# Altium project pcb_thermoklok.PrjPcb
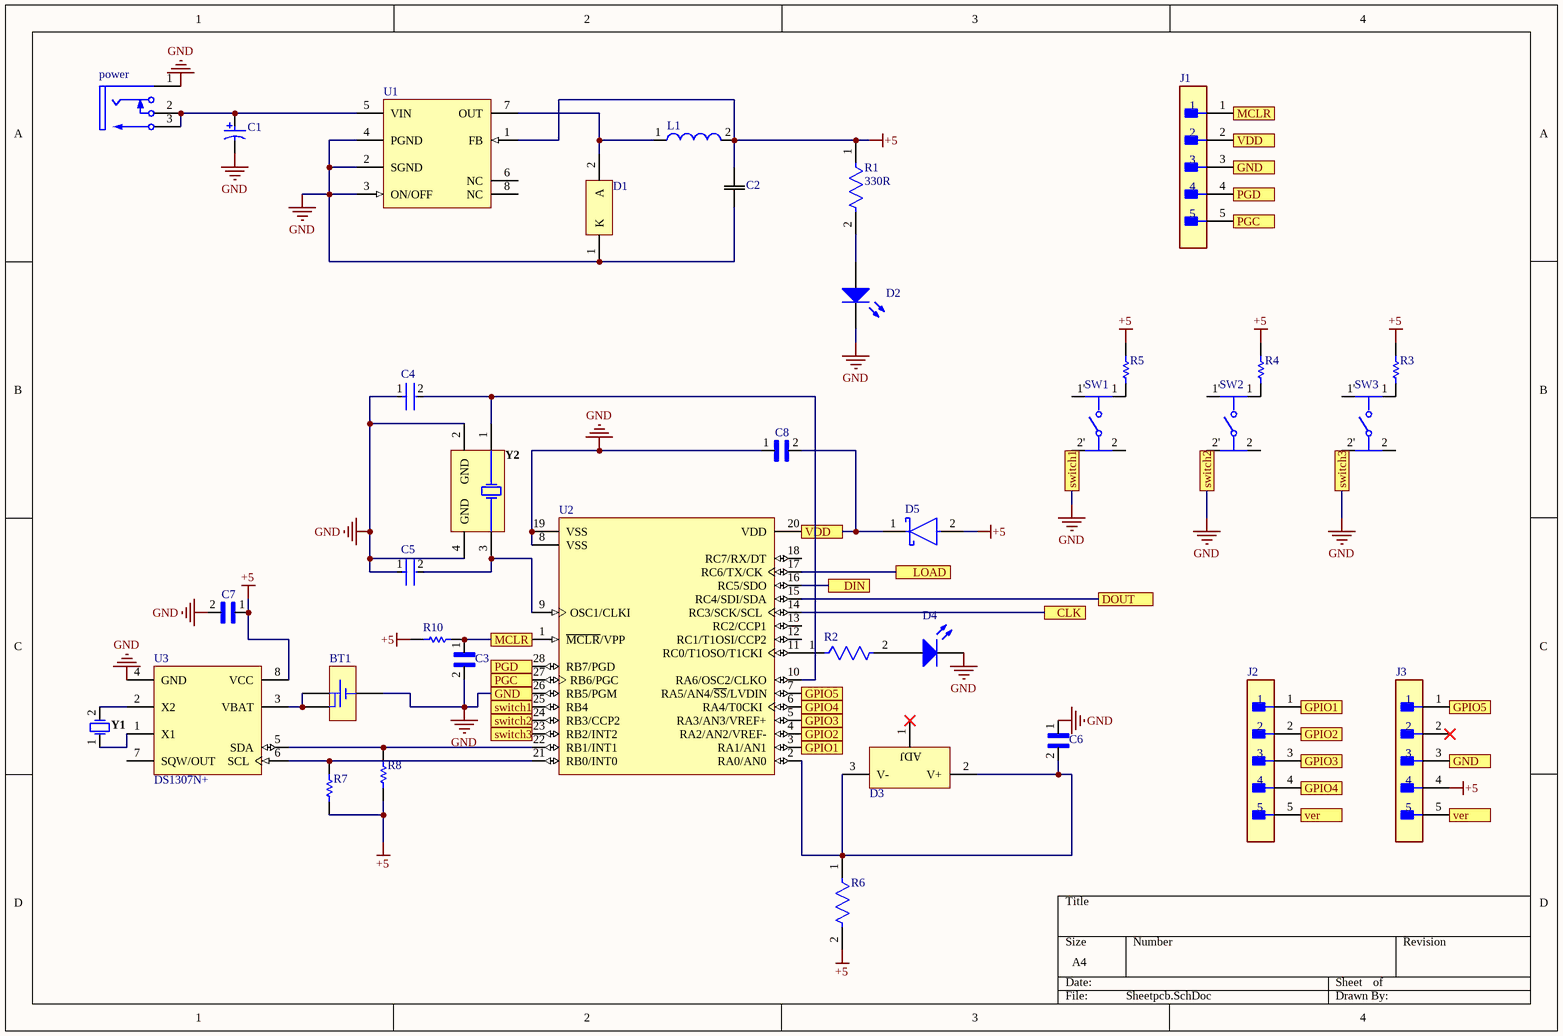
[diagram p0: Sheetpcb.SchDoc]
1 sheet, 36 parts. Net scope: flat (ports and power ports of the same name join across sheets).
Board file: PCB1.PcbDoc

## Sheet Sheetpcb.SchDoc
size A4; SheetNumber: 1; SheetTotal: 2

### Parts
BT1  BAT-HLD-001  [BAT-2]  (value not drawn)
C1  TAJB226K016RNJ  [TO-226-AA]  (value not drawn)
C2  UUD1C221MCL1GS  [NIC-CAPA2-6.3X7.7_V]  (value not drawn)
C3  1206J0630104MXT  [C1206]  (value not drawn)
C4  C0805C220J5GACTU  [6-0805_M]  (value not drawn)
C5  C0805C220J5GACTU  [6-0805_M]  (value not drawn)
C6  1206J0630104MXT  [C1206]  (value not drawn)
C7  1206J0630104MXT  [C1206]  (value not drawn)
C8  1206J0630104MXT  [C1206]  (value not drawn)
D1  MBR150  [ONSC-AXIAL_LEAD-2-59-10_P]  (value not drawn)
D2  151051RS11000  [Type 5mm]  (value not drawn)
D3  LM335AZ/NOPB  [LP0003A]  (value not drawn)
D4  151033GS03000  [3.2X1.6X1.1]  (value not drawn)
D5  BAT42WS-7-F  [FP-SOD323-MFG]  (value not drawn)
J1  IPL1-105-02-L-S-K  [FP-IPL1-105-02-L-S-K-0]  (value not drawn)
J2  IPL1-105-02-L-S-K  [FP-IPL1-105-02-L-S-K-0]  (value not drawn)
J3  IPL1-105-02-L-S-K  [FP-IPL1-105-02-L-S-K-0]  (value not drawn)
L1  744775215  [0402-A]  (value not drawn)
power  RAPC712X  [SWITCH-RAPC712X-3_V]  (value not drawn)
R1  330R  [J1-0603]
R2  CRCW1206330RFKEA  [J1-0603]  (value not drawn)
R3  CRCW120610K0JNEA  [J1-0603]  (value not drawn)
R4  CRCW120610K0JNEA  [J1-0603]  (value not drawn)
R5  CRCW120610K0JNEA  [J1-0603]  (value not drawn)
R6  CRCW12062K00FKEA  [J1-0603]  (value not drawn)
R7  CRCW120610K0JNEA  [J1-0603]  (value not drawn)
R8  CRCW120610K0JNEA  [J1-0603]  (value not drawn)
R10  CRCW120610K0JNEA  [J1-0603]  (value not drawn)
SW1  EVQ-P7A01P  [FP-EVQ-P7A01P-MFG]  (value not drawn)
SW2  EVQ-P7A01P  [FP-EVQ-P7A01P-MFG]  (value not drawn)
SW3  EVQ-P7A01P  [FP-EVQ-P7A01P-MFG]  (value not drawn)
U1  LM2574N-5.0/NOPB  [P0008A]  (value not drawn)
U2  PIC18F252-I/SP  [MCHP-SPDIP-SP28]  (value not drawn)
U3  DS1307N+  [P8+2]
Y1  AB26T-32.768KHZ  [ABRA-AB26T]  (value not drawn)
Y2  7M-27.120MEEQ-T  [R38]  (value not drawn)

### Ports
CLK, DIN, DOUT, GND, GPIO1, GPIO2, GPIO3, GPIO4, GPIO5, LOAD, MCLR, PGC, PGD, switch1, switch2, switch3, VDD, ver

### Nets
+5: C2.2 C7.1 D5.2(A) J3.4 L1.2 R1.1 R3.2 R4.2 R5.2 R6.2 R7.2 R8.1 R10.1 U1.1(FB) U3.8(VCC)
GND: BT1.1(-) C1.2 C2.1 C3.2 C4.1 C5.1 C6.1 C7.2 C8.1 D1.1(K) D2.1(K) D4.1(K) J1.3 J3.3 power.1 SW1.2' SW2.2' SW3.2' U1.2(SGND) U1.3(ON/OFF) U1.4(PGND) U2.8(VSS) U2.19(VSS) U2.23(RB2/INT2) U2.24(RB3/CCP2) U2.25(RB4) U2.26(RB5/PGM) U3.4(GND) Y2.2(GND) Y2.4(GND) ; port GND, port switch1, port switch2, port switch3
NetBT1_2: BT1.2(+) BT1.3(+) U3.3(VBAT)
NetC1_1: C1.1 power.2 power.3 U1.5(VIN)
NetC3_1: C3.1 J1.1 R10.2 U2.1(~{MCLR}/VPP) ; port MCLR
NetC4_2: C4.2 U2.10(RA6/OSC2/CLKO) Y2.1(X1)
NetC5_2: C5.2 U2.9(OSC1/CLKI) Y2.3(X2)
NetC6_2: C6.2 D3.2(V+) D3.3(V-) R6.1 U2.2(RA0/AN0)
NetC8_2: C8.2 D5.1(C) J1.2 U2.20(VDD) ; port VDD
NetD1_2: D1.2(A) L1.1 U1.7(OUT)
NetD2_2: D2.2(A) R1.2
NetD4_2: D4.2(A) R2.2
NetJ1_4: J1.4 U2.28(RB7/PGD) ; port PGD
NetJ1_5: J1.5 U2.27(RB6/PGC) ; port PGC
NetJ2_1: J2.1 U2.3(RA1/AN1) ; port GPIO1
NetJ2_2: J2.2 U2.4(RA2/AN2/VREF-) ; port GPIO2
NetJ2_3: J2.3 U2.5(RA3/AN3/VREF+) ; port GPIO3
NetJ2_4: J2.4 U2.6(RA4/T0CKI) ; port GPIO4
NetJ2_5: J2.5 J3.5 ; port ver
NetJ3_1: J3.1 U2.7(RA5/AN4/~{SS}/LVDIN) ; port GPIO5
NetR2_1: R2.1 U2.11(RC0/T1OSO/T1CKI)
NetR3_1: R3.1 SW3.1
NetR4_1: R4.1 SW2.1
NetR5_1: R5.1 SW1.1
NetR7_1: R7.1 U2.21(RB0/INT0) U3.6(SCL)
NetR8_2: R8.2 U2.22(RB1/INT1) U3.5(SDA)
NetU2_14: U2.14(RC3/SCK/SCL) ; port CLK
NetU2_15: U2.15(RC4/SDI/SDA) ; port DOUT
NetU2_16: U2.16(RC5/SDO) ; port DIN
NetU2_17: U2.17(RC6/TX/CK) ; port LOAD
NetU3_1: U3.1(X1) Y1.1
NetU3_2: U3.2(X2) Y1.2

Not connected (* = marked no-connect by the designer): D3 1(ADJ)*; J3 2*; SW1 1' 2; SW2 1' 2; SW3 1' 2; U1 6(NC) 8(NC); U2 12(RC1/T1OSI/CCP2) 13(RC2/CCP1) 18(RC7/RX/DT); U3 7(SQW/OUT)

### Library data of the parts
BT1 = battery holder: 20mm Coin Cell Battery Holder; Manufacturer: Linx; PCB_Layout: Complies with manufacturer's recommendation.; DatasheetVersion: rev1.0, Dec-2007; PackageVersion: rev1.0, Dec-2007; PackageReference: BATHLD-001; PackageDescription: Low Profile SM Battery Holder, 20mm Lithium Cell, 21.1 x 15.3 x 4.2 mm Body; Manufacturer Part Number: BAT-HLD-001
C1 = 22uf 16 v tantalum capicitor: Standard Tantalum, 22 uF, +/- 10%, 16 V, -55 to 125 degC, 2-Pin SMD (1210), RoHS, Tape and Reel; Manufacturer: AVX; Manufacturer: Kyocera AVX; Leakage Current: 3.5uA; Dissipation Factor: 6%; Voltage Rating (DC): 16V; Capacitance: 22uF; ESR (Equivalent Series Resistance): 2.3Ohm; Polarity: Polar; Package Quantity: 1; Tolerance: 10%; Number of Pins: 2; Manufacturer URL: http://www.avx.com/; Height - Seated (Max): 0.083inch; Case Code (Imperial): 1210; Package Reference: TAJ-B-2; Height: 1.9mm; Depth: 2.8mm; Packaging: TapeandReel; Termination: SMD/SMT; Case/Package: 1210; Lead Free: LeadFree; Min Operating Temperature: -55degC; RoHSCompliant: True; Dielectric Material: Tantalum; Case Code (Metric): 3528; Width: 2.8mm; Datasheet URL: http://datasheets.avx.com/TAJ.pdf; Radiation Hardening: No; Package Description: 2-Pin Surface Mount Device, Body 3.5 x 2.85 mm; Length: 3.5mm; Voltage Rating: 16V; Datasheet Version: 42401.0; Max Operating Temperature: 125degC; REACH SVHC: NoSVHC; Voltage: 16V; Manufacturer Part Number: TAJB226K016RNJ
C2 = UUD1C221MCL1GS: No Description Available; Vendor: Nichicon; Built_By: EMA_UL_Team; SourceLibrary: Nichicon_2014-12-31; Type: DEV; Manufacturer_Part_Number: UUD1C221MCL1GS; Copyright: Copyright (C) 2018 Accelerated Designs. All rights reserved; RefDes: RefDes
C3 C6-C8 = 100nf 63v ceramic capacitor: 63V Ceramic Capacitor; MF: Knowles Syfer; MP: 1206J0630104MXT; SnapEDA_Link: https://www.snapeda.com/parts/1206J0630104MXT/Knowles%20Syfer/view-part/4314687/?ref=snap; DigiKey-Purchase-URL: https://snapeda.com/shop?store=DigiKey&id=4314687; Mouser-Purchase-URL: https://snapeda.com/shop?store=Mouser&id=4314687; Value: *; Digi-Key_Part_Number: 1608-1392-1-ND; Package: 3216 Knowles Syfer
C4 C5 = 22pf 50v ceramic capacitor: Capacitor; Ceramic; Cap; 22.0pF; Tol 5%; SMT; Vol-Rtg 50V; C0G; Tape and Reel; Manufacturer: KEMET; Temperature Coefficient: 30ppm/°C; Capacitance: 22 pF; Value: 22 pF; Tolerance: 0.05; Device Class L1: Passive Components; Mouser Description: Multilayer Ceramic Capacitors MLCC - SMD/SMT 50volts 22pF C0G 5%; Temperature Range Low: -55°C; Automotive: No; Voltage Rating: 50 V; Material: Ceramic; Category: Cap; Height: 0.88mm; Temperature Range High: +125°C; Digikey Description: Capacitor; Ceramic; Cap; 22.0pF; Tol 5%; SMT; Vol-Rtg 50V; C0G; Tape and Reel; Octopart: https://octopart.com/c0805c220j5gactu-kemet-145470; ComponentLink2Description: Datasheet; Device Class L2: Capacitors; Ipc Land Pattern Name: CAPC200125X78; RoHS: TRUE; ComponentLink2URL: https://content.kemet.com/datasheets/KEM_C1003_C0G_SMD.pdf; Temperature: -55°C to +125°C; Device Class L3: Ceramic Capacitors; Lead Free: Yes; Manufacturer Part Number: C0805C220J5GACTU; Temperature Characteristic: C0G; Package: C0805C-DN
D1 = CMP-1055-00047-1: Rectifier, 2-Pin Axial_Lead, Pb-Free, Bulk Bag; Manufacturer: On Semiconductor; IFSM Max (A): 25; Configuration: Single; DatasheetVersion: Rev. 8; ComponentLink1URL: http://www.onsemi.com/; PartNumber: MBR150; ComponentLink2Description: Datasheet; Mounting Technology: Through Hole; RoHS: TRUE; ComponentLink1Description: Manufacturer URL; ComponentLink2URL: http://www.onsemi.cn/pub_link/Collateral/MBR150-D.PDF; Packing: Bulk Bag; PackageVersion: Rev. U, 02/2005; ComponentLink3Description: Package Specification; PackageDescription: 2-Pin, Axial Lead, Diameter 2.35 mm; PackageReference: AXIAL_LEAD-2-59-10; ComponentLink3URL: http://www.onsemi.cn/pub_link/Collateral/59-10.PDF
D2 = CMP-1488-00008-1: THT LED round mono-color color lens, WL-TMRW, Red; Manufacturer: Wuerth Elektronik; PackageReference: Type 5mm; PartNumber: 151051RS11000; ComponentLink2URL: http://katalog.we-online.de/pbs/datasheet/7448042001.pdfhttp://katalog.we-online.de/pbs/datasheet/7448042001.pdfhttp://katalog.we-online.de/pbs/datasheet/7448042001.pdfhttp://katalog.we-online.de/pbs/datasheet/151051RS11000.pdf; ComponentLink1URL: http://www.we-online.com; ComponentLink1Description: Manufacturer URL; ComponentLink2Description: Datasheet; Emitting color: Red
D3 = temperature sensor: Precision Temperature Sensor, 3-pin TO-92, Pb-Free; Manufacturer: Texas Instruments; Manufacturer: TI National Semiconductor; PowerWise: N; CompType: Temp Sensor IC; PackageTopMarking: NSXYTT*LM335*AZ; PinCount: 3; ComponentLink1URL: http://www.ti.com/general/docs/lit/getliterature.tsp?genericPartNumber=LM335&fileType=pdf; Code_JEDEC: TO-226-AA; RoHS: Y; ComponentLink1Description: Datasheet URL; PackageReference: LP0003A; PackageDescription: TO-92, Molded, 3 Lead; Manufacturer Part Number: LM335AZ/NOPB
D4 = green led: THT LED round mono-color waterclear, THT WL-TMRW ,Green; Manufacturer: Wuerth Elektronik; Manufacturer: Wurth Electronics; ComponentLink2URL: http://katalog.we-online.de/pbs/datasheet/7448042001.pdfhttp://katalog.we-online.de/pbs/datasheet/7448042001.pdfhttp://katalog.we-online.de/pbs/datasheet/7448042001.pdfhttp://katalog.we-online.de/pbs/datasheet/151033GS03000.pdf; ComponentLink2Description: Datasheet; Emitting color: Green; ComponentLink1Description: Manufacturer URL; PackageReference: Type 3mm; PartNumber: 151033GS03000; ComponentLink1URL: http://www.we-online.com; Manufacturer Part Number: 151033GS03000
D5 = 30v schottky diode 200mA: DIODE SCHOTTKY 30V 200MA SOD323; Manufacturer: Diodes Inc.; Manufacturer: Diodes; Max Junction Temp: +125°C; Peak Reverse Current: 0.5uA; Max Surge Forward Current: 4A; Standoff Height: 0.05mm; Capacitance: 10pF; Value: 10pF; Package: SOD323; Max Repetitive Reverse Voltage: 30V; Digikey Description: DIODE SCHOTTKY 30V 200MA SOD323; Forward Current: 200mA; Lead Free: Yes; Device Class L1: Discrete Semiconductors; Height: 1.2mm; Mouser Description: Schottky Diodes & Rectifiers 30V 200mW; Footprint Url: https://www.diodes.com/assets/Package-Files/SOD323.pdf; Automotive: No; Device Class L3: Schottky Diodes; Temperature: -55°C to +125°C; ComponentLink2Description: Datasheet; Temperature Range High: +125°C; Manufacturer Part Number: BAT42WS-7-F; ComponentLink2URL: https://www.diodes.com/assets/Datasheets/ds30100.pdf; Reverse Voltage: 30V; Octopart: https://octopart.com/bat42ws-7-f-diodes+inc.-326107; Temperature Range Low: -55°C; Category: Diode; RoHS: TRUE; Device Class L2: Diodes
J1-J3 = 5 header: 5 Position 1 Row .100" (2.54 mm) pitch connector; Manufacturer: Samtec; Number of Positions: 5; Max Current Rating: 7.4A; Pitch: 2.54mm; Connector Type: Male Pin; Max Voltage Rating (AC): 675V; Number of Ports: 1; Gender: Male; Termination: Solder; Min Operating Temperature: -55°C; Max Operating Temperature: 125°C; Mount: Surface Mount; Contact Material: Bronze; Housing Material: Polymer; Depth: 7.04mm; Color: Natural; REACH SVHC: No SVHC; Radiation Hardening: No; Orientation: Straight; Fastening Type: Ramp; Contact Mating Length: 0.215inch; Number of Terminals/Pins: 5; Number of Rows: 1; Packaging: Rail/Tube; Contact Plating: Gold; Length: 14.22mm; Number of Contacts: 5; Lead Free: Lead Free; Manufacturer Part Number: IPL1-105-02-L-S-K
L1 = 150 uh inductor: SMD Power Inductor WE-PD2, L = 150 µH; Manufacturer: Wurth Electronics; Inductance: 150 ÂµH; ComponentLink1Description: Manufacturer Link; ComponentLink2Description: Datasheet; DatasheetVersion: ver 1, Oct-2004; ComponentLink1URL: http://www.we-online.com; PackageDescription: SMD Inductor, 2-Leads, Body 7.8 x 7.0 mm; PackageVersion: 2004; PackageReference: WE-PD2-L; ComponentLink2URL: http://www.we-online.de/katalog/media/pdf/744775215.pdf; Manufacturer Part Number: 744775215
power = CMP-2000-05383-1: Conn Powerjack Mini R/A PCMT, 5 A, 3-Pin THD, RoHS; Manufacturer: Switchcraft; Gender: Male; Current Rating: 5A; Connector Type: Jack; Dynamic Catalog: SwitchcraftInc; Other Names: Q2387461 / Q2526383 / RAPC712X-ND / SC237; Internal Switch(s): SingleSwitch,NormallyClosed; Catalog Drawings: RAPC7(1,2)2XSide / RAPC7(1,2)2XTop; Plug/Mating Plug Diameter: 2.5mmID,5.5mmOD; Number of Positions/Contacts: 2Conductors,2Contacts; Shielding: Unshielded; Mating Products: SC1539-ND / -CONNPLUGMINIPWR2CONDBLK/RED / SC1051-ND / -CONNPLUGMINIPOWER2CONDBLACK; Mounting Type: ThroughHole,RightAngle; Manufacturer URL: http://www.switchcraft.com/; Contact Material: Brass; Standard Package: 2,500; RoHS Information: SwitchcraftRoHSInfo; Termination: SolderEyelet(s); Housing Color: Black; Datasheet Version: Rev. A, 08/2005; Family: Barrel-PowerConnectors; Housing Material: Thermoplastic; Color: Black; Datasheet URL: https://datasheet.ciiva.com/391/rapc712x-cd-391666.pdf; Category: Connectors,Interconnects; Contact Material - Plating: Nickel
R1 = 330 ohm resistor: RES Thick Film, 330Ω, 1%, 0.25W, 100ppm/°C, 1206; Manufacturer: Vishay; Manufacturer Part Number: CRCW1206330RFKEA; Voltage Rating: 200V; Max Power Dissipation: 250mW; Height: 0.55mm; Mount: Surface Mount; Min Operating Temperature: -55°C; Depth: 1.6mm; Features: Automotive AEC-Q200; Voltage Rating (DC): 200V; Military Standard: Not; Packaging: Tape and Reel; Composition: Thick Film; Contact Plating: Tin; Case Code (Imperial): 1206; Case/Package: 1206; Number of Terminations: 2; Length: 3.2mm; Lead Free: Lead Free; Tolerance: 1%; Resistance: 330R; Temperature Coefficient: 100ppm/°C; Case Code (Metric): 3216; Width: 1.6mm; Weight: 0.000353oz; Termination: SMD/SMT; Radiation Hardening: No; Package Quantity: 10; Power Rating: 250mW; Max Operating Temperature: 155°C
R2 = 330 ohm resistor: RES Thick Film, 330Ω, 1%, 0.25W, 100ppm/°C, 1206; Manufacturer: Vishay; Voltage Rating: 200V; Resistance: 330R; Max Power Dissipation: 250mW; Height: 0.55mm; Mount: Surface Mount; Min Operating Temperature: -55°C; Depth: 1.6mm; Features: Automotive AEC-Q200; Voltage Rating (DC): 200V; Military Standard: Not; Packaging: Tape and Reel; Composition: Thick Film; Contact Plating: Tin; Case Code (Imperial): 1206; Case/Package: 1206; Number of Terminations: 2; Length: 3.2mm; Lead Free: Lead Free; Tolerance: 1%; Temperature Coefficient: 100ppm/°C; Case Code (Metric): 3216; Width: 1.6mm; Weight: 0.000353oz; Termination: SMD/SMT; Radiation Hardening: No; Package Quantity: 10; Power Rating: 250mW; Max Operating Temperature: 155°C; Manufacturer Part Number: CRCW1206330RFKEA
R3-R5 R7 R8 R10 = 10K ohm resistor: Manufacturer: Vishay Dale; Part Number: CRCW120610K0JNEA; Manufacturer Part Number: CRCW120610K0JNEA
R6 = 2Kohm resistor: RES Thick Film, 2kΩ, 1%, 0.25W, 100ppm/°C, 1206; Manufacturer: Vishay; Manufacturer: Vishay Dale; Manufacturer Part Number: CRCW12062K00FKTC; Manufacturer: Yageo; Manufacturer Part Number: RC1206FR-072KL; Manufacturer: Panasonic; Manufacturer Part Number: ERJ-8ENF2001V; Manufacturer Part Number: CRCW12062K00FKTA; Manufacturer Part Number: CRCW12062K00FKTB; Manufacturer: Bourns; Manufacturer Part Number: CR1206-FX-2001ELF; Manufacturer: Rohm; Manufacturer Part Number: MCR18EZPF2001; Manufacturer Part Number: CRCW12062K00FKEB; Max Power Dissipation: 250mW; Voltage Rating: 200V; Resistance: 2kR; Package Quantity: 10; Height: 0.55mm; Tolerance: 1%; Number of Terminations: 2; Mount: Surface Mount; Width: 1.6mm; Length: 3.2mm; Features: Automotive AEC-Q200; Contact Plating: Tin; Number of Pins: 2; Weight: 0.000353oz; Max Operating Temperature: 155°C; Min Operating Temperature: -55°C; Termination: SMD/SMT; Temperature Coefficient: 100ppm/°C; Case Code (Imperial): 1206; Depth: 1.6mm; Military Standard: Not; Case Code (Metric): 3216; Composition: Thick Film; Power Rating: 250mW; Case/Package: 1206; Radiation Hardening: No; Packaging: Tape and Reel; Manufacturer Part Number: CRCW12062K00FKEA
SW1-SW3 = switch: SWITCH TACTILE SPST-NO 0.05A 12V; Manufacturer: Panasonic; Operating Force: 2.2N; Contact Resistance: 500mΩ; Contact Current Rating: 50mA; Electromechanical Life: 100000Cycles; Device Class L2: Switches; Lead Free: Yes; Mount: Surface Mount; Digikey Description: SWITCH TACTILE SPST-NO 0.05A 12V; Temperature Range High: +70°C; Device Class L3: Tactile Switches; Package: EVQ-P7A01P; Voltage Rating Dc: 12V; Octopart: https://octopart.com/evq-p7a01p-panasonic-29917075; ComponentLink2URL: https://industrial.panasonic.com/cdbs/www-data/pdf/ATK0000/ATK0000C378.pdf; Automotive: No; Device Class L1: Electromechanical; Mouser Description: SWITCH TACTILE SPST-NO 0.05A 12V; Temperature: -20°C to +70°C; Manufacturer Part Number: EVQ-P7A01P; ComponentLink2Description: Datasheet; RoHS: TRUE; Category: Switch; Temperature Range Low: -20°C; Throw Configuration: SPST-NO; Height: 1.55mm
U1 = 0.5A stepdown conveter: SIMPLE SWITCHER® 0.5A Step-Down Voltage Regulator, 8-pin MDIP, Pb-Free; Manufacturer: Texas Instruments; Manufacturer: TI National Semiconductor; PowerWise: N; PackageTopMarking: NSUZXYTTE#*LM2574N*-5.0 P+; PinCount: 8; ComponentLink1URL: http://www.ti.com/general/docs/lit/getliterature.tsp?genericPartNumber=LM2574&fileType=pdf; CompType: Switcher; Code_JEDEC: MS-001-BA; ComponentLink1Description: Datasheet URL; RoHS: Y; PackageDescription: MDIP, .365 x .250 x .130in, 8 Lead, .100in Pitch; PackageReference: P0008A; Manufacturer Part Number: LM2574N-5.0/NOPB
U2 = microcontroller: High Performance, Enhanced Flash Microcontroller with 10-Bit A/D, 40 MHz, 23 I/O, -40 to 85 degC, 28-pin SPDIP (SP28), Tube; Manufacturer: Microchip; # of A/D Channels: 5; Program Memory KBytes: 32; Operation Voltage Range: 4.2V - 5.5V; Program Memory KWords: 16; RAM: 1536; Timers: 1 - 8-bit, 3 - 16-bit; EEPROM Data Memory (bytes): 256; Max. CPU Speed MHz: 40; I/O Pins: 23; Digital Communication: 0 -UART, 1 -A/E/USART, 0 -SPI, 0 -I2C, 1 -MSSP(SPI/I2C); ComponentLink3URL: Product URL:http://www.microchip.com/datasheet/PIC18F252; PackageReference: SPDIP-SP28; RoHS: TRUE; ComponentLink1URL: http://ww1.microchip.com/downloads/en/DeviceDoc/39564c.pdf; PackageDescription: 28-Lead Plastic Dual In-Line, 34.86 x 6.79 mm Body, 2.54 mm Pitch; PartNumber: PIC18F252-I/SP; ComponentLink1Description: Datasheet; Memory Type: Flash; Packing: TUBE; ComponentLink2URL: http://www.microchip.com/stellent/groups/techpub_sg/documents/packagingspec/en012702.pdf; DatasheetVersion: Rev. C; ComponentLink2Description: Package Specification; ComponentLink3Description: URL Link1; Mounting Technology: Through Hole; PackageVersion: C04-070B, 12/2012; Manufacturer Part Number: PIC18F252-I/SP
U3 = clock: 64 x 8, Serial, I2C Real-Time Clock, 5.0V, 8-Pin PDIP, -40 to 85 degC, Pb-Free; Manufacturer: Maxim; ComponentLink1Description: Manufacturer URL; ComponentLink2Description: Datasheet; DatasheetVersion: 10-Feb-2008; PackageDescription: 8-Pin Plastic Dual-In-Line, Narrow (0.3in), Pitch 2.54 mm, PDIP(N), Pb-Free; ComponentLink3URL: http://pdfserv.maxim-ic.com/package_dwgs/21-0043.PDF; PackageReference: P8+2; PackageVersion: revE, 2011; ComponentLink3Description: Package Specification; Code_JEDEC: MS-001-AB; ComponentLink1URL: http://www.maxim-ic.com; ComponentLink2URL: http://datasheets.maxim-ic.com/en/ds/DS1307.pdf; Manufacturer Part Number: DS1307N+
Y1 = 32.768 Khz crystal: Crystal, 12.5 pF, 32.768 KHz, -10 to 60 degC, 2-Pin THD, RoHS, Bulk; Manufacturer: ABRACON; ESR: 35kOhms; Frequency Stability: -0.034PPM; Load Capacitance: 12.5pF; Tolerance: 20PPM; Case Length: 6.2mm; Case Diameter: 2.1mm; RoHS: Details; Product Category: Crystals; Type: WatchCrystal; Manufacturer URL: http://www.abracon.com/; Operating Temperature Range: -10Cto+60C; Package Description: 2-Pin Through Hole Device, Dia 2.1 mm, Body Length 6.2 mm; Termination Style: Radial; Datasheet Version: 06/2010; Datasheet URL: http://www.abracon.com/Resonators/AB26T.pdf; Packaging: Bulk; Factory Pack Quantity: 500; Brand: ABRACON; Mounting Technology: ThroughHole; Package URL: http://www.abracon.com/Support/PackageDrawing/Resonators/AB26T.PDF; Package / Case: Cylinder; Lead Spacing: 0.8mm; Dimensions: 2.1mmDia.x6.2mmL; Mounting Style: ThroughHole; Frequency: 32.768kHz; Package Reference: AB26T; Series: AB26T; Manufacturer: Abracon; Manufacturer Part Number: AB26T-32.768KHZ
Y2 = 10hz crystal: Seam Crystal, 7M Series, 3 pF, -40 to 85 degC, 4-Pin SMD, RoHS, Tape and Reel; Manufacturer: TXC; ESR (Equivalent Series Resistance): 60Ohm; Operating Mode: Fundamental; Frequency Stability: ±10ppm; Other Names: 887-1329-1; Catalog Drawings: 7MSeriesTop / 7MSeriesBottom / 7MSeriesSide / 7MSeriesCircuit; Frequency: 27.12MHz; Load Capacitance: 10pF; Mounting Technology: SurfaceMount; Type: MHzCrystal; Height: 0.031"(0.80mm); Mounting Type: SurfaceMount; Series: 7M; Package Reference: 7M-4; Size / Dimension: 0.126"Lx0.098"W(3.20mmx2.50mm); Package Description: 4-Pin Surface Mount Device, Body 3.2 x 2.5 mm; Datasheet URL: http://datasheet.octopart.com/7M-27.120MEEQ-T-TXC-datasheet-10979173.pdf; Operating Temperature: -20°C~70°C; Datasheet Version: 02/2010; Family: Crystals; Dynamic Catalog: 7MSeries; Packaging: CutTape(CT); Manufacturer URL: http://www.txccorp.com/; Standard Package: 1; Category: CrystalsandOscillators; Frequency Tolerance: ±10ppm; Package / Case: 4-SMD,NoLead(DFN,LCC); Manufacturer Part Number: 7M-27.120MEEQ-T